# EAGLE design ModbusSwitch_v1_0 (EAGLE 6.4)
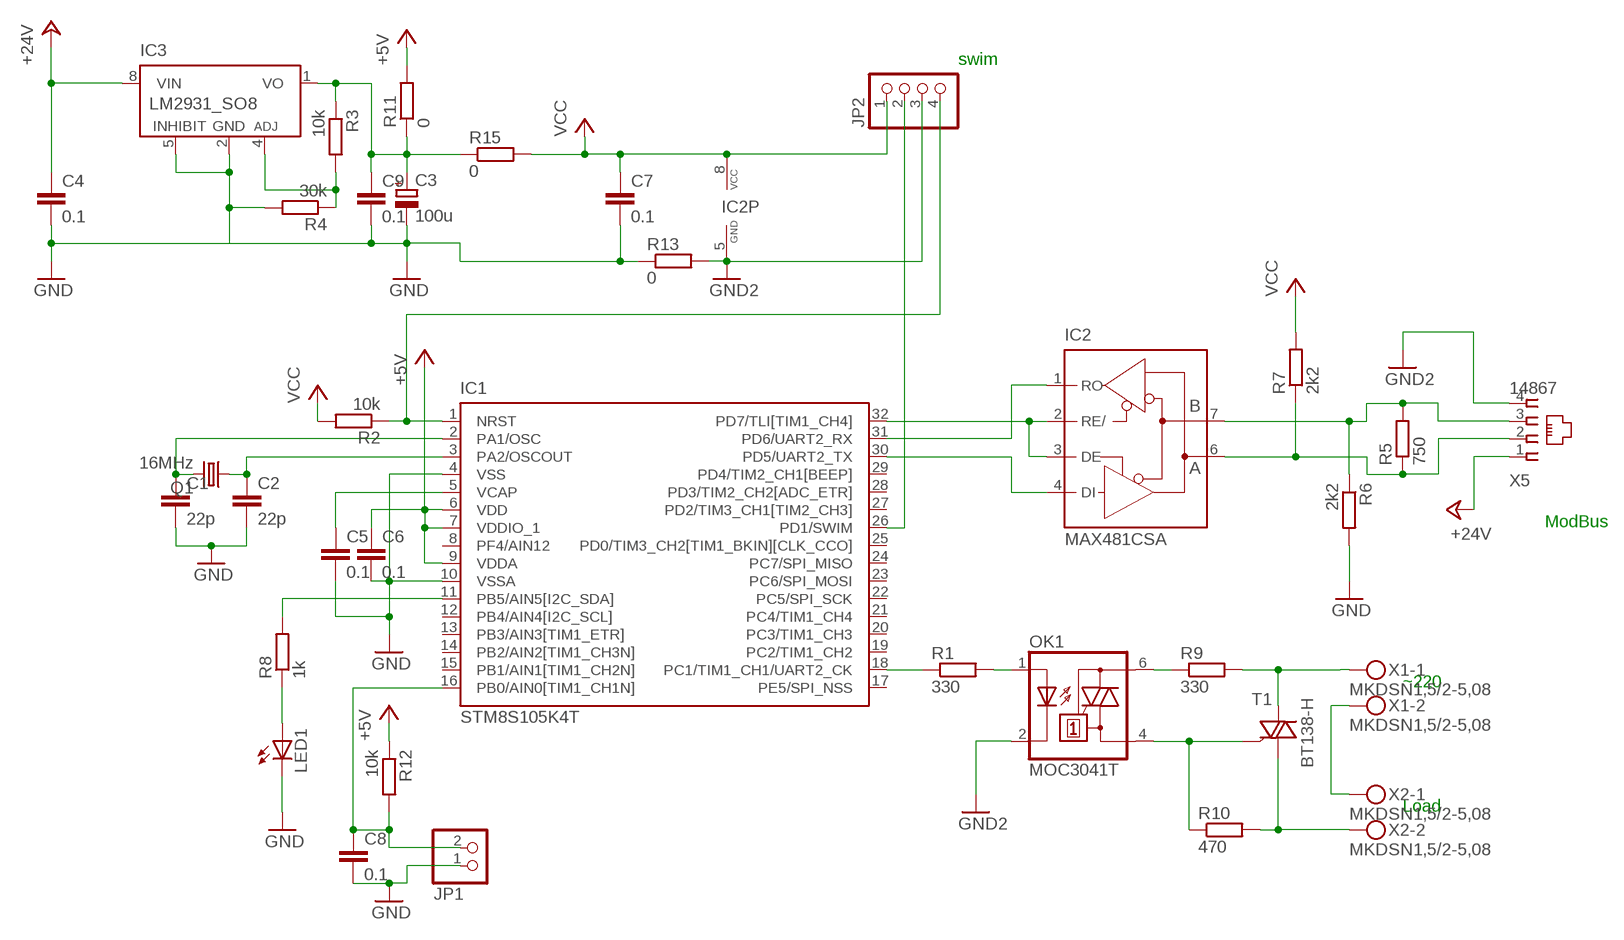
[diagram p0: schematic, sheet 1]

## Parts
C1  22p  C-EUC0603  [C0603]
C2  22p  C-EUC0603  [C0603]
C3  100u  CPOL-EUE2.5-6  [E2,5-6]
C4  0.1  C-EUC1206  [C1206]
C5  0.1  C-EUC0603  [C0603]
C6  0.1  C-EUC0603  [C0603]
C7  0.1  C-EUC0603  [C0603]
C8  0.1  C-EUC0603  [C0603]
C9  0.1  C-EUC0603  [C0603]
IC1  STM8S105K4T  [LQFP32-7X7]
IC2  MAX481CSA  [SO08]
IC3  LM2931_SO8  [SO-08]
JP1  PINHD-1X2/90  [1X02/90]
JP2  PINHD-1X4  [1X04]
LED1  LED3MM  [LED3MM]
OK1  MOC3041T  [DIL06B]
Q1  16MHz  CRYSTALHC49S  [HC49/S]
R1  330  R-EU_R0805  [R0805]
R2  10k  R-EU_R0603  [R0603]
R3  10k  R-EU_R0603  [R0603]
R4  30k  R-EU_R0603  [R0603]
R5  750  R-EU_R0603  [R0603]
R6  2k2  R-EU_R0603  [R0603]
R7  2k2  R-EU_R0603  [R0603]
R8  1k  R-EU_R0603  [R0603]
R9  330  R-EU_R1206  [R1206]
R10  470  R-EU_R1206  [R1206]
R11  0  R-EU_R1206  [R1206]
R12  10k  R-EU_R0603  [R0603]
R13  0  R-EU_R1206  [R1206]
R15  0  R-EU_R1206  [R1206]
T1  BT138-H  [TO220BH]
X1  MKDSN1,5/2-5,08  [MKDSN1,5/2-5,08]
X2  MKDSN1,5/2-5,08  [MKDSN1,5/2-5,08]
X5  14867  [14867]

## Nets
+5V: C6.1 IC1.6(VDD) IC1.7(VDDIO_1) IC1.9(VDDA) R11.2 R12.1
+24V: C4.1 IC3.8(VIN) X5.1
GND: C1.2 C2.2 C3.- C4.2 C5.2 C6.2 C7.2 C8.2 C9.2 IC1.4(VSS) IC1.10(VSSA) IC3.2(GND) IC3.5(INHIBIT) JP1.1 LED1.K(C) R4.2 R6.2 R13.1
GND2: IC2.5(GND) JP2.3 OK1.2(C) R13.2 X5.4
N$1: IC1.32(PD7/TLI[TIM1_CH4]) IC2.2(RE/) IC2.3(DE)
N$2: IC1.30(PD5/UART2_TX) IC2.4(DI)
N$3: IC1.31(PD6/UART2_RX) IC2.1(RO)
N$4: C5.1 IC1.5(VCAP)
N$7: IC1.11(PB5/AIN5[I2C_SDA]) R8.2
N$8: LED1.A R8.1
N$9: IC1.18(PC1/TIM1_CH1/UART2_CK) R1.1
N$10: OK1.1(A) R1.2
N$11: OK1.4(A1) R10.1 T1.G
N$12: IC1.1(NRST) JP2.4 R2.1
N$13: X1.2 X2.1
N$14: R10.2 T1.T1(A1) X2.2
N$15: C3.+ C9.1 IC3.1(VO) R3.1 R11.1 R15.1
N$16: C2.1 IC1.3(PA2/OSCOUT) Q1.1
N$17: C1.1 IC1.2(PA1/OSC) Q1.2
N$18: OK1.6(A2) R9.1
N$19: IC2.6(A) R5.1 R7.1 X5.2
N$20: R9.2 T1.T2(A2) X1.1
N$21: IC3.4(ADJ) R3.2 R4.1
N$23: C8.1 IC1.16(PB0/AIN0[TIM1_CH1N]) JP1.2 R12.2
N$25: IC1.26(PD1/SWIM) JP2.2
N$26: IC2.7(B) R5.2 R6.1 X5.3
VCC: C7.1 IC2.8(VCC) JP2.1 R2.2 R7.2 R15.2
Unconnected: IC1.8(PF4/AIN12) IC1.12(PB4/AIN4[I2C_SCL]) IC1.13(PB3/AIN3[TIM1_ETR]) IC1.14(PB2/AIN2[TIM1_CH3N]) IC1.15(PB1/AIN1[TIM1_CH2N]) IC1.17(PE5/SPI_NSS) IC1.19(PC2/TIM1_CH2) IC1.20(PC3/TIM1_CH3) IC1.21(PC4/TIM1_CH4) IC1.22(PC5/SPI_SCK) IC1.23(PC6/SPI_MOSI) IC1.24(PC7/SPI_MISO) IC1.25(PD0/TIM3_CH2[TIM1_BKIN][CLK_CCO]) IC1.27(PD2/TIM3_CH1[TIM2_CH3]) IC1.28(PD3/TIM2_CH2[ADC_ETR]) IC1.29(PD4/TIM2_CH1[BEEP])

## Notes on the sheet
- swim
- ModBus
- ~220
- Load

## Power pins joined to a net without a drawn wire
GND$1: IC3.3(GND$1)
GND$2: IC3.6(GND$2)
GND$3: IC3.7(GND$3)

## Library data of the parts
C1 C2 C4-C9 = resistor:C-EU: CAPACITOR, European symbol
C3 = rcl:CPOL-EU: POLARIZED CAPACITOR, European symbol
IC1 = BYCE_switch:STM8S105K: Access line, 16 MHz STM8S 8-bit MCU up to 32 Kbytes Flash, integrated EEPROM,10-bit ADC, timers, UART, SPI, I²C Source: Data sheet <http://www.st.com/stonline/products/literature/ds/14771/stm8s105c4.pdf>; MPN: STM8S105K4T6C; OC_FARNELL: 1706223; OC_NEWARK: 09R6034
IC2 = BYCE_switch:MAX481CSA: RS485 TRANSEIVER
IC3 = WattMeter:LM2931_SO8
JP1 = pinhead:PINHD-1X2: PIN HEADER
JP2 = pinhead:PINHD-1X4: PIN HEADER
LED1 = led:LED: LED OSRAM: - CHIPLED LG R971, LG N971, LY N971, LG Q971, LY Q971, LO R971, LY R971 LH N974, LH R974 LS Q976, LO Q976, LY Q976 LO Q996 - Hyper CHIPLED LW Q18S LB Q993, LB Q99A, LB R99A - SideLED LS A670, LO A670, LY A670, LG A670, LP A670 LB A673, LV A673, LT A673, LW A673 LH A674 LY A675 LS A676, LA A676, LO A676, LY A676, LW A676 LS A679, LY A679, LG A679 - Hyper Micro SIDELED® LS Y876, LA Y876, LO Y876, LY Y876 LT Y87S - SmartLED LW L88C, LW L88S LB L89C, LB L89S, LG L890 LS L89K, LO L89K, LY L89K LS L896, LA L896, LO L896, LY L896 - TOPLED LS T670, LO T670, LY T670, LG T670, LP T670 LSG T670, LSP T670, LSY T670, LOP T670, LYG T670 LG T671, LOG T671, LSG T671 LB T673, LV T673, LT T673, LW T673 LH T674 LS T676, LA T676, LO T676, LY T676, LB T676, LH T676, LSB T676, LW T676 LB T67C, LV T67C, LT T67C, LS T67K, LO T67K, LY T67K, LW E67C LS E67B, LA E67B, LO E67B, LY E67B, LB E67C, LV E67C, LT E67C LW T67C LS T679, LY T679, LG T679 LS T770, LO T770, LY T770, LG T770, LP T770 LB T773, LV T773, LT T773, LW T773 LH T774 LS E675, LA E675, LY E675, LS T675 LS T776, LA T776, LO T776, LY T776, LB T776 LHGB T686 LT T68C, LB T68C - Hyper Mini TOPLED® LB M676 - Mini TOPLED Santana® LG M470 LS M47K, LO M47K, LY M47K Source: http://www.osram.convergy.de LUXEON: - LUMILED® LXK2-PW12-R00, LXK2-PW12-S00, LXK2-PW14-U00, LXK2-PW14-V00 LXK2-PM12-R00, LXK2-PM12-S00, LXK2-PM14-U00 LXK2-PE12-Q00, LXK2-PE12-R00, LXK2-PE12-S00, LXK2-PE14-T00, LXK2-PE14-U00 LXK2-PB12-K00, LXK2-PB12-L00, LXK2-PB12-M00, LXK2-PB14-N00, LXK2-PB14-P00, LXK2-PB14-Q00 LXK2-PR12-L00, LXK2-PR12-M00, LXK2-PR14-Q00, LXK2-PR14-R00 LXK2-PD12-Q00, LXK2-PD12-R00, LXK2-PD12-S00 LXK2-PH12-R00, LXK2-PH12-S00 LXK2-PL12-P00, LXK2-PL12-Q00, LXK2-PL12-R00 Source: www.luxeon.com KINGBRIGHT: KA-3528ASYC Source: www.kingbright.com
OK1 = optocoupler:MOC30*: 6-Pin DIP Zero-Cross Optoisolators Triac Driver Output (250/400 Volt Peak) Source: http://www.fairchildsemi.com/ds/MO/MOC3043-M.pdf; OC_FARNELL: unknown; OC_NEWARK: unknown
Q1 = crystal:CRYSTAL: CRYSTAL
R1-R10 R12 = resistor:R-EU_: RESISTOR, European symbol
R11 R13 R15 = rcl:R-EU_: RESISTOR, European symbol
T1 = triac:BT138: TRIAC Source: http://www.semiconductors.philips.com BT138_SERIES_2.pdf
X1 X2 = con-phoenix-508:MKDSN1,5/2-5,08: MKDSN 1,5/ 2-5,08 Printklemme Nennstrom: 13,5 A Nennspannung: 250 V Rastermaß: 5,08 mm Polzahl: 2 Anschlussart: Schraubanschluss Montage: Löten Anschlussrichtung Leiter/Platine: 0 ° Artikelnummer: 1729128 Source: http://eshop.phoenixcontact.com .. 1729128.pdf; MPN: MKDSN 1,5/2-5.08; OC_FARNELL: 1792903; OC_NEWARK: 30M2397
X5 = WattMeter:14867: RJ11 Connector Source: 4UCON TECHNOLOGY INC. 14867.pdf; OC_FARNELL: unknown; OC_NEWARK: unknown

## Board
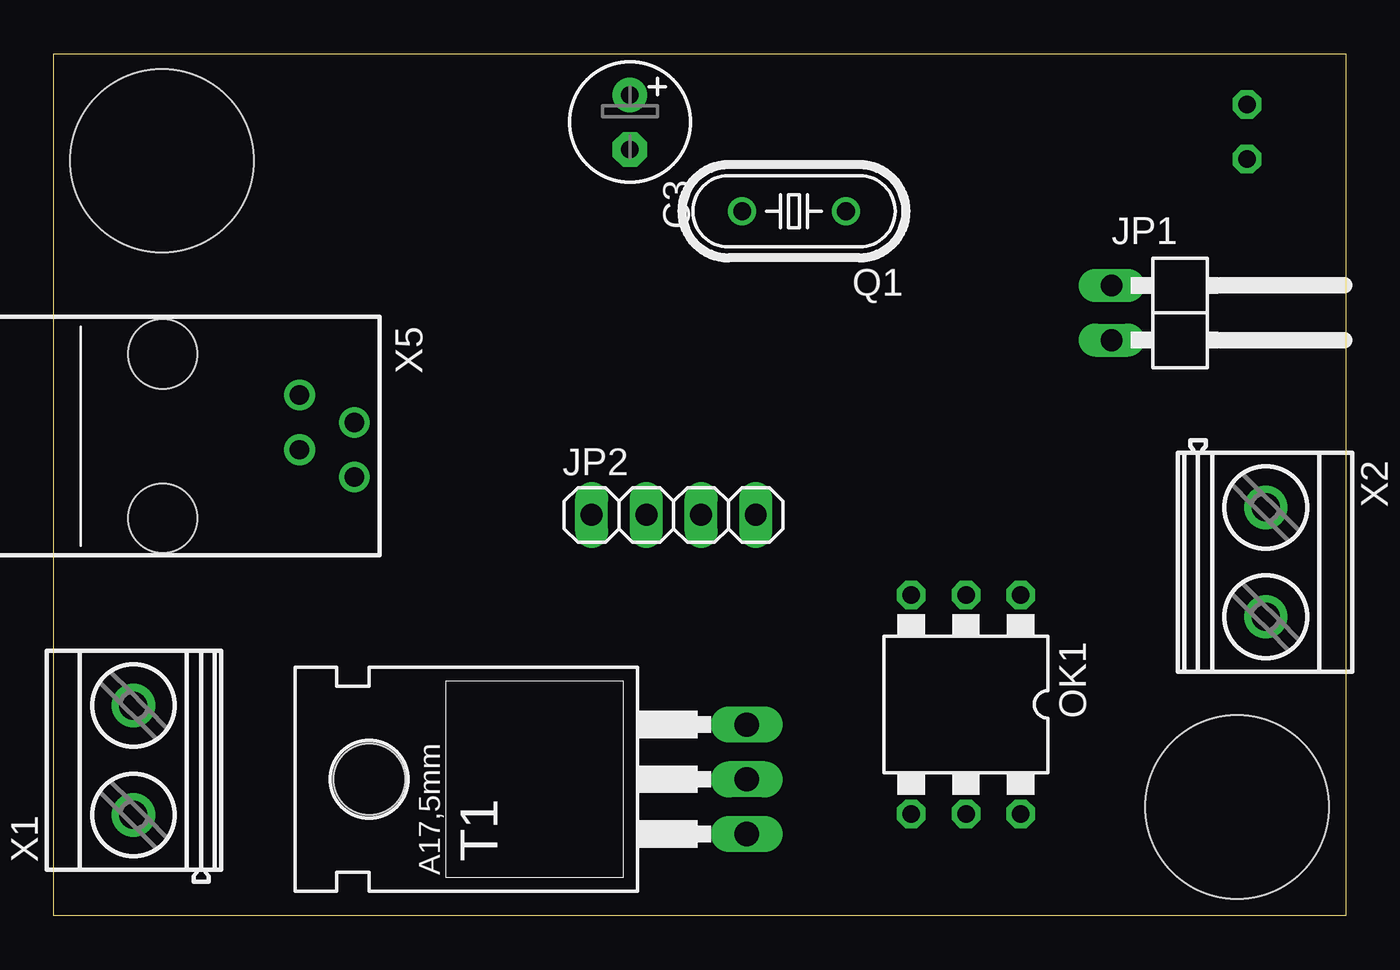
[diagram p1: board, top side]
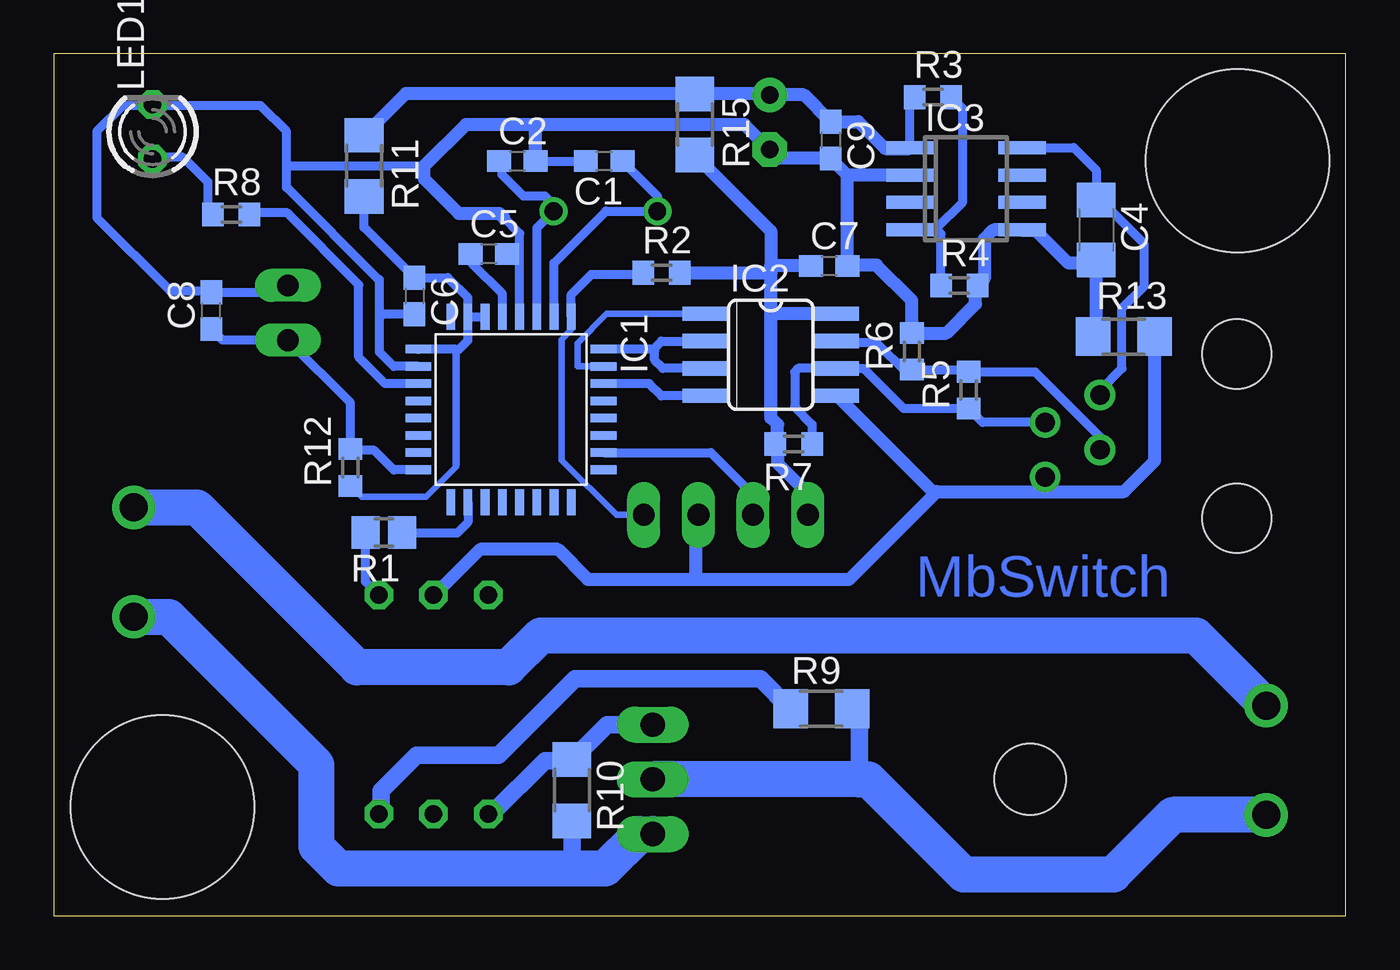
[diagram p2: board, bottom side, seen from below]

Size 59.98 x 40 mm. Coordinates in mm from the lower left corner, seen from the top.
Outline: 59.98,0 0,0 0,40 59.98,40 59.98,0
Copper layers (1*16): Top 0.035mm / dielectric 1.5mm / Bottom 0.035mm
Design rules "default *": minimum track width 8mil, minimum drill 24mil, track to track 10mil, track to pad 10mil, pad to pad 10mil, via to via 10mil, smd to smd 8mil, copper to edge 40mil, drill to drill 8mil, minimum pad ring 10mil, minimum via ring 8mil, stop-mask expansion 4mil, vias tented up to drill 0mil, thermal gap 10mil
Holes 8.5 mm at 54.94,5.04 5.02,35.04

### Footprints (pad centres in the part's own frame; a part is rotated, then mirrored left to right if it is on the bottom)
C0603 = smd 1.1 x 1: 1 -0.85,0; 2 0.85,0
E2,5-6 = drill 0.813 pad 1.6: + -1.27,0 | drill 0.813 pad 1.6 octagon: - 1.27,0
C1206 = smd 1.6 x 1.8: 1 -1.4,0; 2 1.4,0
LQFP32-7X7 = smd 1.2 x 0.4: 1 -4.3,2.8; 2 -4.3,2; 3 -4.3,1.2; 4 -4.3,0.4; 5 -4.3,-0.4; 6 -4.3,-1.2; 7 -4.3,-2; 8 -4.3,-2.8; 17 4.3,-2.8; 18 4.3,-2; 19 4.3,-1.2; 20 4.3,-0.4; 21 4.3,0.4; 22 4.3,1.2; 23 4.3,2; 24 4.3,2.8 | smd 0.4 x 1.2: 9 -2.8,-4.3; 10 -2,-4.3; 11 -1.2,-4.3; 12 -0.4,-4.3; 13 0.4,-4.3; 14 1.2,-4.3; 15 2,-4.3; 16 2.8,-4.3; 25 2.8,4.3; 26 2,4.3; 27 1.2,4.3; 28 0.4,4.3; 29 -0.4,4.3; 30 -1.2,4.3; 31 -2,4.3; 32 -2.8,4.3
SO08 = smd 0.66 x 2.032: 1 -1.905,-3.073; 2 -0.635,-3.073; 3 0.635,-3.073; 4 1.905,-3.073; 5 1.905,3.073; 6 0.635,3.073; 7 -0.635,3.073; 8 -1.905,3.073
SO-08 = smd 0.6 x 2.2: 1 -1.905,-2.6; 2 -0.635,-2.6; 3 0.635,-2.6; 4 1.905,-2.6; 5 1.905,2.6; 6 0.635,2.6; 7 -0.635,2.6; 8 -1.905,2.6
1X02/90 = drill 1.016 long: 1 -1.27,-3.81; 2 1.27,-3.81
1X04 = drill 1.016 long: 1 -3.81,0; 2 -1.27,0; 3 1.27,0; 4 3.81,0
LED3MM = drill 0.813 octagon: A -1.27,0; K 1.27,0
DIL06B = drill 0.813 octagon: 1 -2.54,-5.08; 2 0,-5.08; 3 2.54,-5.08; 4 2.54,5.08; 5 0,5.08; 6 -2.54,5.08
HC49/S = drill 0.813: 1 -2.413,0; 2 2.413,0
R0805 = smd 1.3 x 1.5: 1 -0.85,0; 2 0.85,0
R0603 = smd 1 x 1.1: 1 -0.85,0; 2 0.85,0
R1206 = smd 1.6 x 1.803: 1 -1.422,0; 2 1.422,0
TO220BH = drill 1.118 long: G 2.54,-6.35; T1 -2.54,-6.35; T2 0,-6.35 | hole 3.302: 0,11.176
MKDSN1,5/2-5,08 = drill 1.3 pad 2: 1 -2.561,0.025; 2 2.519,0.025
14867 = drill 0.9 pad 1.422: 1 -1.905,6.35; 2 -0.635,8.89; 3 0.635,6.35; 4 1.905,8.89 | hole 3.2: -3.81,0; 3.81,0

### Placement (x,y rotation side)
C1  34.43,35.02 180 bottom
C2  38.46,35.02 0 bottom
C3  26.75,36.83 270 top
C4  11.58,31.83 270 bottom
C5  39.78,30.72 0 bottom
C6  43.24,28.76 270 bottom
C7  23.98,30.16 0 bottom
C8  52.67,28.09 90 bottom
C9  23.91,36 270 bottom
IC1  38.75,23.5 270 bottom
IC2  26.69,26.04 270 bottom
IC3  17.62,33.74 270 bottom
JP1  52.92,27.98 270 top
JP2  28.78,18.6 0 top
LED1  55.39,36.38 90 bottom
OK1  42.35,9.8 180 top
Q1  34.36,32.7 180 top
R1  44.65,17.79 180 bottom
R2  31.76,29.84 0 bottom
R3  19.16,37.99 0 bottom
R4  17.94,29.25 0 bottom
R5  17.51,24.39 90 bottom
R6  20.14,26.19 90 bottom
R7  25.63,21.9 180 bottom
R8  51.74,32.55 0 bottom
R9  24.34,9.61 0 bottom
R10  35.93,5.82 270 bottom
R11  45.58,34.8 270 bottom
R12  46.21,20.8 90 bottom
R13  10.3,26.88 0 bottom
R15  30.22,36.72 270 bottom
T1  25.82,6.33 90 top
X1  3.72,7.24 90 top
X2  56.24,16.39 270 top
X5  5.06,22.26 270 top

### Tracks (layer width: path | path; a pad name or v marks a point on that pad's centre or on a via)
+5V
  Bottom 0.305: 41.29,20.95 41.29,20.84 42.7,19.44 45.7,19.44 R12.1
  Bottom 0.358: 41.29,20.95 41.29,26.29
  Bottom 0.406: IC1.7 40.75,26.7 41.17,26.29 41.29,26.29 IC1.9 | IC1.7 IC1.6 | IC1.7 40.75,28.67 41.7,29.61 C6.1 45.58,31.95 R11.2
+24V
  Bottom 0.406: X5.1 11.41,24.37 10.38,25.4 10.38,28.2 9.38,29.2 9.38,31.2 10.98,32.8 11.16,32.8 C4.1 11.58,34.6 12.62,35.65 IC3.8
GND
  Bottom 0.406: 26.34,35.15 C3.- | 39.08,32.38 38.38,31.68 | 38.38,31.68 38.38,30.72 C5.2 | IC1.4 38.35,31.66 38.38,31.68 | 52.8,28.8 C8.2 | C8.2 49.43,28.93 JP1.1 49.13,29.25 49.38,29 | IC1.10 44.2,25.5 44.86,26.16 44.86,28.08 | 44.86,28.08 44.86,29.52 44.9,29.52 49.18,33.8 49.18,34.8 | 55.37,37.68 LED1.K | C6.2 44.69,27.91 44.86,28.08 | 23.68,35.38 C9.2 | 49.18,34.8 42.78,34.8 | 49.18,34.8 49.18,36.4 50.38,37.6 55.34,37.6 LED1.K | 52.6,29 54.58,29 57.98,32.4 57.98,36.4 56.78,37.6 55.38,37.6 55.38,37.64 LED1.K | 52.58,29 52.6,29 | 52.6,29 C8.2 | 17.18,29.16 R4.2 | C2.2 C1.2
  Bottom 0.61: 26.34,35.15 C9.2 23.14,34.38 | C3.- 27.91,36.72 37.38,36.72 | 23.14,34.38 23.13,34.37 C7.2 23.13,30.2 21.78,30.2 20.14,28.56 R6.2 18.54,27.04 17.18,28.4 17.18,29.16 | 39.08,32.38 39.3,32.6 41.18,32.6 42.78,34.2 42.78,34.8 40.86,36.72 37.38,36.72 | R4.2 16.78,29.55 16.78,31.4 16.34,31.84 IC3.5 14.99,31.8 14.38,31.8 12.87,30.29 11.72,30.29 C4.2 11.58,26.88 R13.1 | C2.2 37.61,36.49 37.38,36.72 | IC3.2 23.14,34.38
GND2
  Bottom 0.305: OK1.2 42.29,14.88
  Bottom 0.406: R13.2 8.86,26.88 8.86,26.8 | X5.4 13.98,20.36 13.98,20.32
  Bottom 0.61: 13.98,19.68 10.29,19.68 8.86,21.12 8.86,26.8 8.86,26.86 | 13.98,20.32 13.98,19.68 | IC2.5 19.17,19.68 18.98,19.68 | 18.98,19.68 13.98,19.68 | 18.98,19.68 23.07,15.6 30.18,15.6 | 30.18,15.6 35.18,15.6 36.58,17 40.18,17 42.29,14.88 | JP2.3 30.18,18.47 30.18,15.6
N$1
  Bottom 0.406: 32.14,26.3 IC1.32 | 32.14,26.3 31.77,26.67 IC2.2 | IC2.3 31.71,25.4 32.09,25.78 32.09,26.24 32.14,26.3
N$2
  Bottom 0.406: IC1.30 32.33,24.7 31.77,24.13 IC2.4
N$3
  Bottom 0.305: IC1.31 35.67,25.5 35.67,26.57 34.31,27.94 IC2.1
N$4
  Bottom 0.406: IC1.5 39.15,28.86 40.54,30.24 40.54,30.62 C5.1
N$7
  Bottom 0.406: IC1.11 44.59,24.7 45.82,25.92 45.82,29.28 49.18,32.64 50.79,32.64 R8.2
N$8
  Bottom 0.406: R8.1 52.82,32.55 52.82,34.05 53.98,35.2 55.31,35.2 LED1.A
N$9
  Bottom 0.406: IC1.18 40.75,18.27 41.26,17.76 43.78,17.76 R1.1
N$10
  Bottom 0.406: OK1.1 45.5,15.5 R1.2
N$11
  Bottom 0.813: 35.78,7.39 R10.1 | OK1.4 39.65,4.72 37.18,7.2 35.97,7.2 R10.1 | T1.G 34.3,8.87 R10.1
N$12
  Bottom 0.305: IC1.1 35.95,27.18 36.4,26.73 36.4,21.14 33.86,18.6 JP2.4
  Bottom 0.406: IC1.1 35.95,28.82 35.02,29.76 32.69,29.76 R2.1
N$13
  Bottom 1.676: X2.1 53.33,18.95 45.9,11.52 38.86,11.52 37.38,13 6.94,13 X1.2
N$14
  Bottom 0.813: R10.2 35.93,2.45 36.18,2.2
  Bottom 1.676: X2.2 54.65,13.87 47.78,7 47.78,3.2 46.78,2.2 36.18,2.2 34.38,2.2 32.79,3.79 T1.T1
N$15
  Bottom 0.406: 30.16,38.1 30.22,38.16 R15.1 30.24,38.16 | C3.+ 26.79,38.14 | IC3.1 20.23,37.77 R3.1
  Bottom 0.61: C3.+ 25.16,38.1 C9.1 22.63,36.85 21.38,35.6 20.27,35.6 IC3.1 | 26.79,38.14 R15.1 | 30.24,38.16 43.64,38.16 R11.1
N$16
  Bottom 0.406: IC1.3 37.55,31.92 Q1.1 36.78,33 37.18,33.4 38.18,33.4 39.18,34.4 39.18,34.9 C2.1
N$17
  Bottom 0.406: IC1.2 36.75,30.29 34.35,32.7 Q1.2 31.95,33.4 C1.1
N$18
  Bottom 0.813: OK1.6 44.78,4.83 44.78,5.8 43.14,7.44 39.34,7.44 35.78,11 27.18,11 25.79,9.61 R9.1
N$19
  Bottom 0.406: X5.2 16.86,22.89 R5.1 20.53,23.55 22.38,25.4 IC2.6 25.42,25.4 25.58,25.24 25.58,23.6 24.78,22.8 R7.1
N$20
  Bottom 0.813: R9.2 22.58,9.28 22.58,6.33
  Bottom 1.676: X1.1 8.03,4.67 10.78,1.92 17.74,1.92 22.15,6.33 22.58,6.33 T1.T2
N$21
  Bottom 0.406: 19.02,31.88 20.18,31.88 IC3.4 | 19.02,31.88 17.78,33.12 17.78,37.46 R3.2 | R4.1 18.79,31.65 19.02,31.88
N$23
  Bottom 0.406: IC1.16 44.2,20.7 45.1,21.6 46.16,21.6 R12.2 46.21,23.8 JP1.2 52.14,26.71 C8.1
N$25
  Bottom 0.406: IC1.26 29.48,21.5 27.58,19.6 27.58,18.67 JP2.2
N$26
  Bottom 0.406: X5.3 11.38,21.66 11.38,22.2 14.43,25.25 R5.2 17.61,25.34 R6.1 20.28,25.2 20.38,25.2 21.78,26.6 23.55,26.6 IC2.7
VCC
  Bottom 0.406: IC2.8 23.72,27.84 | 26.77,29.84 26.69,29.76 | 26.55,27.94 26.69,27.8
  Bottom 0.61: R15.2 26.69,31.77 26.69,30.2 | 26.69,30.2 26.69,29.76 26.69,27.8 26.69,23.11 26.38,22.8 26.38,21.99 R7.2 26.38,21.8 26.38,21 24.97,19.59 JP2.1 | R2.2 26.77,29.84 | C7.1 26.65,30.16 26.69,30.2 | IC2.8 26.55,27.94

### Text on the board
Bottom: MbSwitch